# EAGLE schematic Schematic v10 (EAGLE 9.7.0)
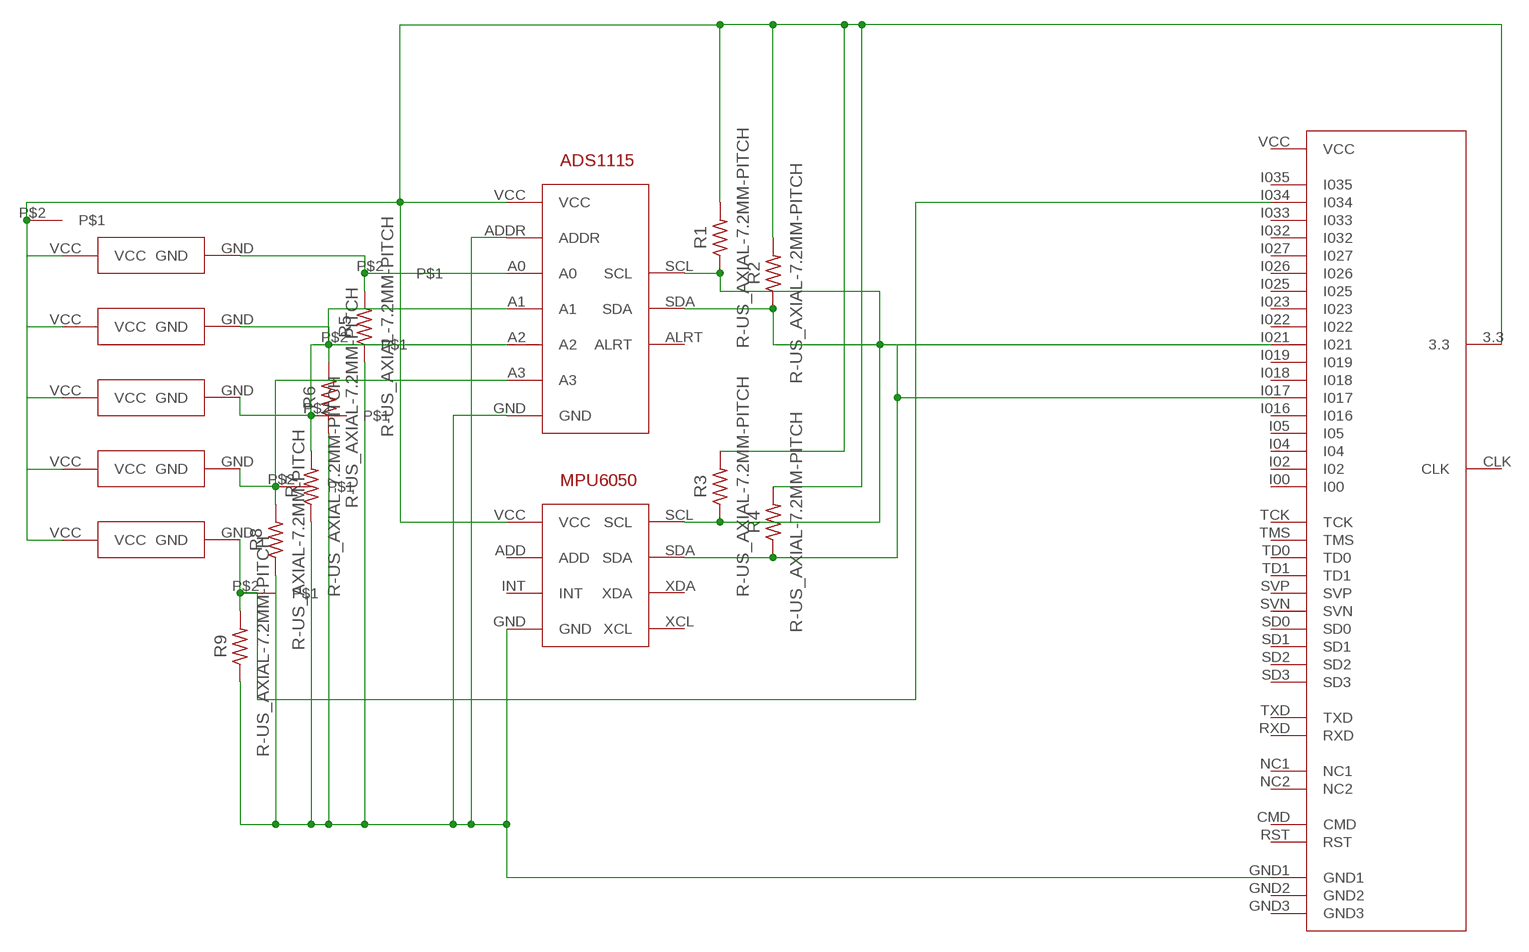
[diagram p0: schematic, sheet 1]

## Parts
R1  R-US_AXIAL-7.2MM-PITCH  [RESAD724W46L381D178B]
R2  R-US_AXIAL-7.2MM-PITCH  [RESAD724W46L381D178B]
R3  R-US_AXIAL-7.2MM-PITCH  [RESAD724W46L381D178B]
R4  R-US_AXIAL-7.2MM-PITCH  [RESAD724W46L381D178B]
R5  R-US_AXIAL-7.2MM-PITCH  [RESAD724W46L381D178B]
R6  R-US_AXIAL-7.2MM-PITCH  [RESAD724W46L381D178B]
R7  R-US_AXIAL-7.2MM-PITCH  [RESAD724W46L381D178B]
R8  R-US_AXIAL-7.2MM-PITCH  [RESAD724W46L381D178B]
R9  R-US_AXIAL-7.2MM-PITCH  [RESAD724W46L381D178B]
U$1  ADS1115  [ADS1115]
U$2  MPU6050  [MPU6050]
U$3  FSR402  [FSR402]
U$5  FSR402  [FSR402]
U$7  FSR402  [FSR402]
U$8  FSR402  [FSR402]
U$9  FSR402  [FSR402]
U$10  ESP32  [ESP32]
U$11  PTHHOLE  [PTHHOLE]
U$12  PTHHOLE  [PTHHOLE]
U$13  PTHHOLE  [PTHHOLE]
U$14  PTHHOLE  [PTHHOLE]
U$15  PTHHOLE  [PTHHOLE]
U$16  PTHHOLE  [PTHHOLE]

## Nets
N$2: R9.2 U$9.GND U$10.I034 U$11.P$2
N$3: R5.2 U$1.A0 U$3.GND U$15.P$2
N$4: R6.2 U$1.A1 U$5.GND U$14.P$2
N$5: R8.2 U$1.A3 U$8.GND U$12.P$2
N$6: R7.2 U$1.A2 U$7.GND U$13.P$2
N$7: R5.1 R6.1 R7.1 R8.1 R9.1 U$1.ADDR U$1.GND U$2.GND U$10.GND1
N$8: R1.2 R2.2 R3.2 R4.2 U$1.VCC U$2.VCC U$3.VCC U$5.VCC U$7.VCC U$8.VCC U$9.VCC U$10.3.3 U$16.P$2
N$9: R1.1 R3.1 U$1.SCL U$2.SCL U$10.I021
N$11: R2.1 R4.1 U$1.SDA U$2.SDA U$10.I017
Unconnected: U$1.ALRT U$2.ADD U$2.INT U$2.XCL U$2.XDA U$10.CLK U$10.CMD U$10.GND2 U$10.GND3 U$10.I00 U$10.I02 U$10.I04 U$10.I05 U$10.I016 U$10.I018 U$10.I019 U$10.I022 U$10.I023 U$10.I025 U$10.I026 U$10.I027 U$10.I032 U$10.I033 U$10.I035 U$10.NC1 U$10.NC2 U$10.RST U$10.RXD U$10.SD0 U$10.SD1 U$10.SD2 U$10.SD3 U$10.SVN U$10.SVP U$10.TCK U$10.TD0 U$10.TD1 U$10.TMS U$10.TXD U$10.VCC

## Library data of the parts
R1-R9 = Resistor:R-US: Resistor Fixed - ANSI; CATEGORY: Resistor; SUB-CATEGORY: Fixed
U$1 = ADS1115:ADS1115
U$2 = MPU6050:MPU6050
U$3 U$5 U$7-U$9 = FSR402:FSR402
U$10 = ESP32:ESP32
U$11-U$16 = PTHHole:PTHHOLE

## Module ADS1115
Ports: VDD(io) GND(io) SCL(io) SDA(io) ADDR(io) ALRT(io) A0(io) A1(io) A2(io) A3(io)

### Library data of the parts